# EAGLE design transponder (EAGLE 7.5.0)
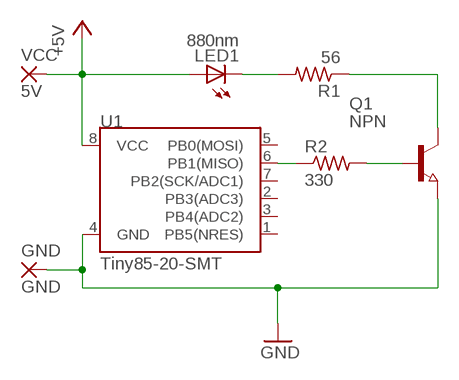
[diagram p0: schematic, sheet 1]

## Parts
GND  GND  SMD2  [SMD1,27-2,54]
LED1  880nm  LED3MM  [LED3MM]
Q1  NPN  NPN-TRANSISTOR_SOT23  [SOT23]
R1  56  R-US_R0603  [R0603]
R2  330  R-US_R0603  [R0603]
U1  Tiny85-20-SMT  ATTINY45TINY85-20-SMT  [SO08-EIAJ]
VCC  5V  SMD2  [SMD1,27-2,54]

## Nets
+5V: LED1.A U1.8(VCC) VCC.1(P)
GND: GND.1(P) Q1.2(E) U1.4(GND)
N$1: R2.1 U1.6(PB1(MISO))
N$2: Q1.1(B) R2.2
N$3: LED1.K(C) R1.2
N$4: Q1.3(C) R1.1
Unconnected: U1.1(PB5(NRES)) U1.2(PB3(ADC3)) U1.3(PB4(ADC2)) U1.5(PB0(MOSI)) U1.7(PB2(SCK/ADC1))

## Library data of the parts
GND VCC = wirepad:SMD2: SMD PAD
LED1 = led:LED: LED OSRAM: - CHIPLED LG R971, LG N971, LY N971, LG Q971, LY Q971, LO R971, LY R971 LH N974, LH R974 LS Q976, LO Q976, LY Q976 LO Q996 - Hyper CHIPLED LW Q18S LB Q993, LB Q99A, LB R99A - SideLED LS A670, LO A670, LY A670, LG A670, LP A670 LB A673, LV A673, LT A673, LW A673 LH A674 LY A675 LS A676, LA A676, LO A676, LY A676, LW A676 LS A679, LY A679, LG A679 - Hyper Micro SIDELED® LS Y876, LA Y876, LO Y876, LY Y876 LT Y87S - SmartLED LW L88C, LW L88S LB L89C, LB L89S, LG L890 LS L89K, LO L89K, LY L89K LS L896, LA L896, LO L896, LY L896 - TOPLED LS T670, LO T670, LY T670, LG T670, LP T670 LSG T670, LSP T670, LSY T670, LOP T670, LYG T670 LG T671, LOG T671, LSG T671 LB T673, LV T673, LT T673, LW T673 LH T674 LS T676, LA T676, LO T676, LY T676, LB T676, LH T676, LSB T676, LW T676 LB T67C, LV T67C, LT T67C, LS T67K, LO T67K, LY T67K, LW E67C LS E67B, LA E67B, LO E67B, LY E67B, LB E67C, LV E67C, LT E67C LW T67C LS T679, LY T679, LG T679 LS T770, LO T770, LY T770, LG T770, LP T770 LB T773, LV T773, LT T773, LW T773 LH T774 LS E675, LA E675, LY E675, LS T675 LS T776, LA T776, LO T776, LY T776, LB T776 LHGB T686 LT T68C, LB T68C - Hyper Mini TOPLED® LB M676 - Mini TOPLED Santana® LG M470 LS M47K, LO M47K, LY M47K Source: http://www.osram.convergy.de LUXEON: - LUMILED® LXK2-PW12-R00, LXK2-PW12-S00, LXK2-PW14-U00, LXK2-PW14-V00 LXK2-PM12-R00, LXK2-PM12-S00, LXK2-PM14-U00 LXK2-PE12-Q00, LXK2-PE12-R00, LXK2-PE12-S00, LXK2-PE14-T00, LXK2-PE14-U00 LXK2-PB12-K00, LXK2-PB12-L00, LXK2-PB12-M00, LXK2-PB14-N00, LXK2-PB14-P00, LXK2-PB14-Q00 LXK2-PR12-L00, LXK2-PR12-M00, LXK2-PR14-Q00, LXK2-PR14-R00 LXK2-PD12-Q00, LXK2-PD12-R00, LXK2-PD12-S00 LXK2-PH12-R00, LXK2-PH12-S00 LXK2-PL12-P00, LXK2-PL12-Q00, LXK2-PL12-R00 Source: www.luxeon.com KINGBRIGHT: KA-3528ASYC Source: www.kingbright.com
Q1 = semicon-smd-ipc:NPN-TRANSISTOR_: NPN TRANSISTOR
R1 R2 = resistor:R-US_: RESISTOR, American symbol
U1 = SparkFun-DigitalIC:ATTINY45: Atmel 8-pin 2/4/8kB flash uC; PROD_ID: IC-09092

## Board
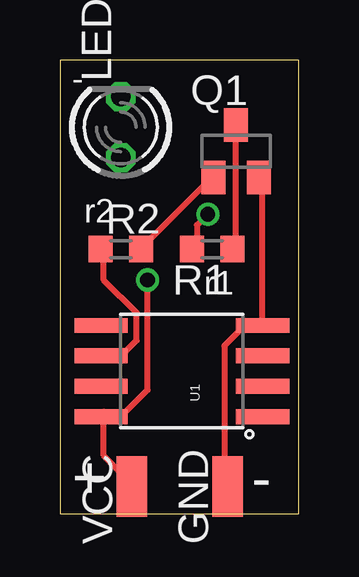
[diagram p1: board, top side]
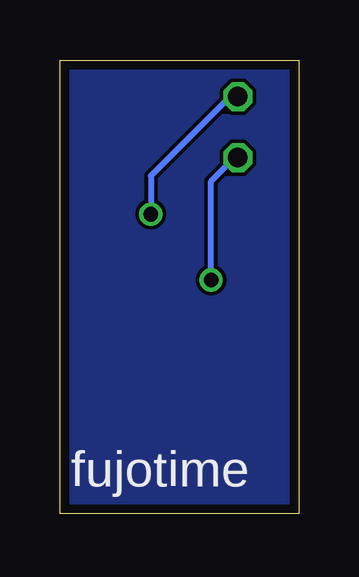
[diagram p2: board, bottom side, seen from below]

Size 9.96 x 18.91 mm. Coordinates in mm from the lower left corner, seen from the top.
Outline: 0,0 9.96,0 9.96,18.91 0,18.91 0,0
Copper layers (1*16): Top 0.0356mm / dielectric 1.5011mm / Bottom 0.0356mm
Design rules "LaenPCBOrder": minimum track width 6mil, minimum drill 13mil, track to track 6mil, track to pad 6mil, pad to pad 6mil, via to via 6mil, smd to smd 6mil, copper to edge 15mil, drill to drill 6mil, minimum pad ring 7mil, minimum via ring 7mil, stop-mask expansion 3mil, vias tented up to drill 0mil, thermal gap 10mil

### Footprints (pad centres in the part's own frame; a part is rotated, then mirrored left to right if it is on the bottom)
SMD1,27-2,54 = smd 1.27 x 2.54: 1 0,0
LED3MM = drill 0.813 octagon: A -1.27,0; K 1.27,0
SOT23 = smd 1 x 1.4: 1 -0.95,-1.1; 2 0.95,-1.1; 3 0,1.1
R0603 = smd 1 x 1.1: 1 -0.85,0; 2 0.85,0
SO08-EIAJ = smd 0.61 x 2.21: 1 -1.905,-3.378; 2 -0.635,-3.378; 3 0.635,-3.378; 4 1.905,-3.378; 5 1.905,3.353; 6 0.635,3.353; 7 -0.635,3.353; 8 -1.905,3.353

### Placement (x,y rotation side)
GND  7,1.14 0 top
LED1  2.54,16.11 90 top
Q1  7.35,15.11 0 top
R1  6.35,11.03 180 top
R2  2.54,11.03 0 top
U1  5.08,5.94 90 top
VCC  3,1.14 0 top

### Tracks (layer width: path | path; a pad name or v marks a point on that pad's centre or on a via)
+5V  (via drill 0.61)
  Top 0.254: VCC.1 2.97,1.28 1.83,2.42 1.83,4.02 U1.8 1.83,4.25 2.74,4.25 3.66,5.16 v3.66,9.74
  Bottom 0.254: v3.66,9.74 3.66,13.85 2.74,14.77 LED1.A
GND
  Top 0.254: Q1.2 8.46,13.85 U1.4 8.46,7.68 7.54,7.68 6.86,6.99 6.86,1.28 GND.1
N$1
  Top 0.254: R2.1 1.83,10.88 1.83,9.74 3.2,8.37 3.2,7.22 2.74,6.76 1.83,6.76 U1.6
N$2
  Top 0.254: R2.2 3.43,11.11 6.17,13.85 Q1.1
N$3  (via drill 0.61)
  Top 0.254: v6.17,12.48 5.71,12.02 5.71,11.11 R1.2
  Bottom 0.254: v6.17,12.48 6.17,14.08 2.74,17.51 LED1.K
N$4
  Top 0.254: R1.1 7.32,11.11 7.32,16.14 Q1.3
N$5
  pour Bottom: 0,0.14 10,0.14 10,1.14 10,19.14 0,19.14

### Text on the board
tPlace: - | r2 | r1 | + | -
bPlace: fujotime